# EAGLE design EndStop (EAGLE 7.2.0)
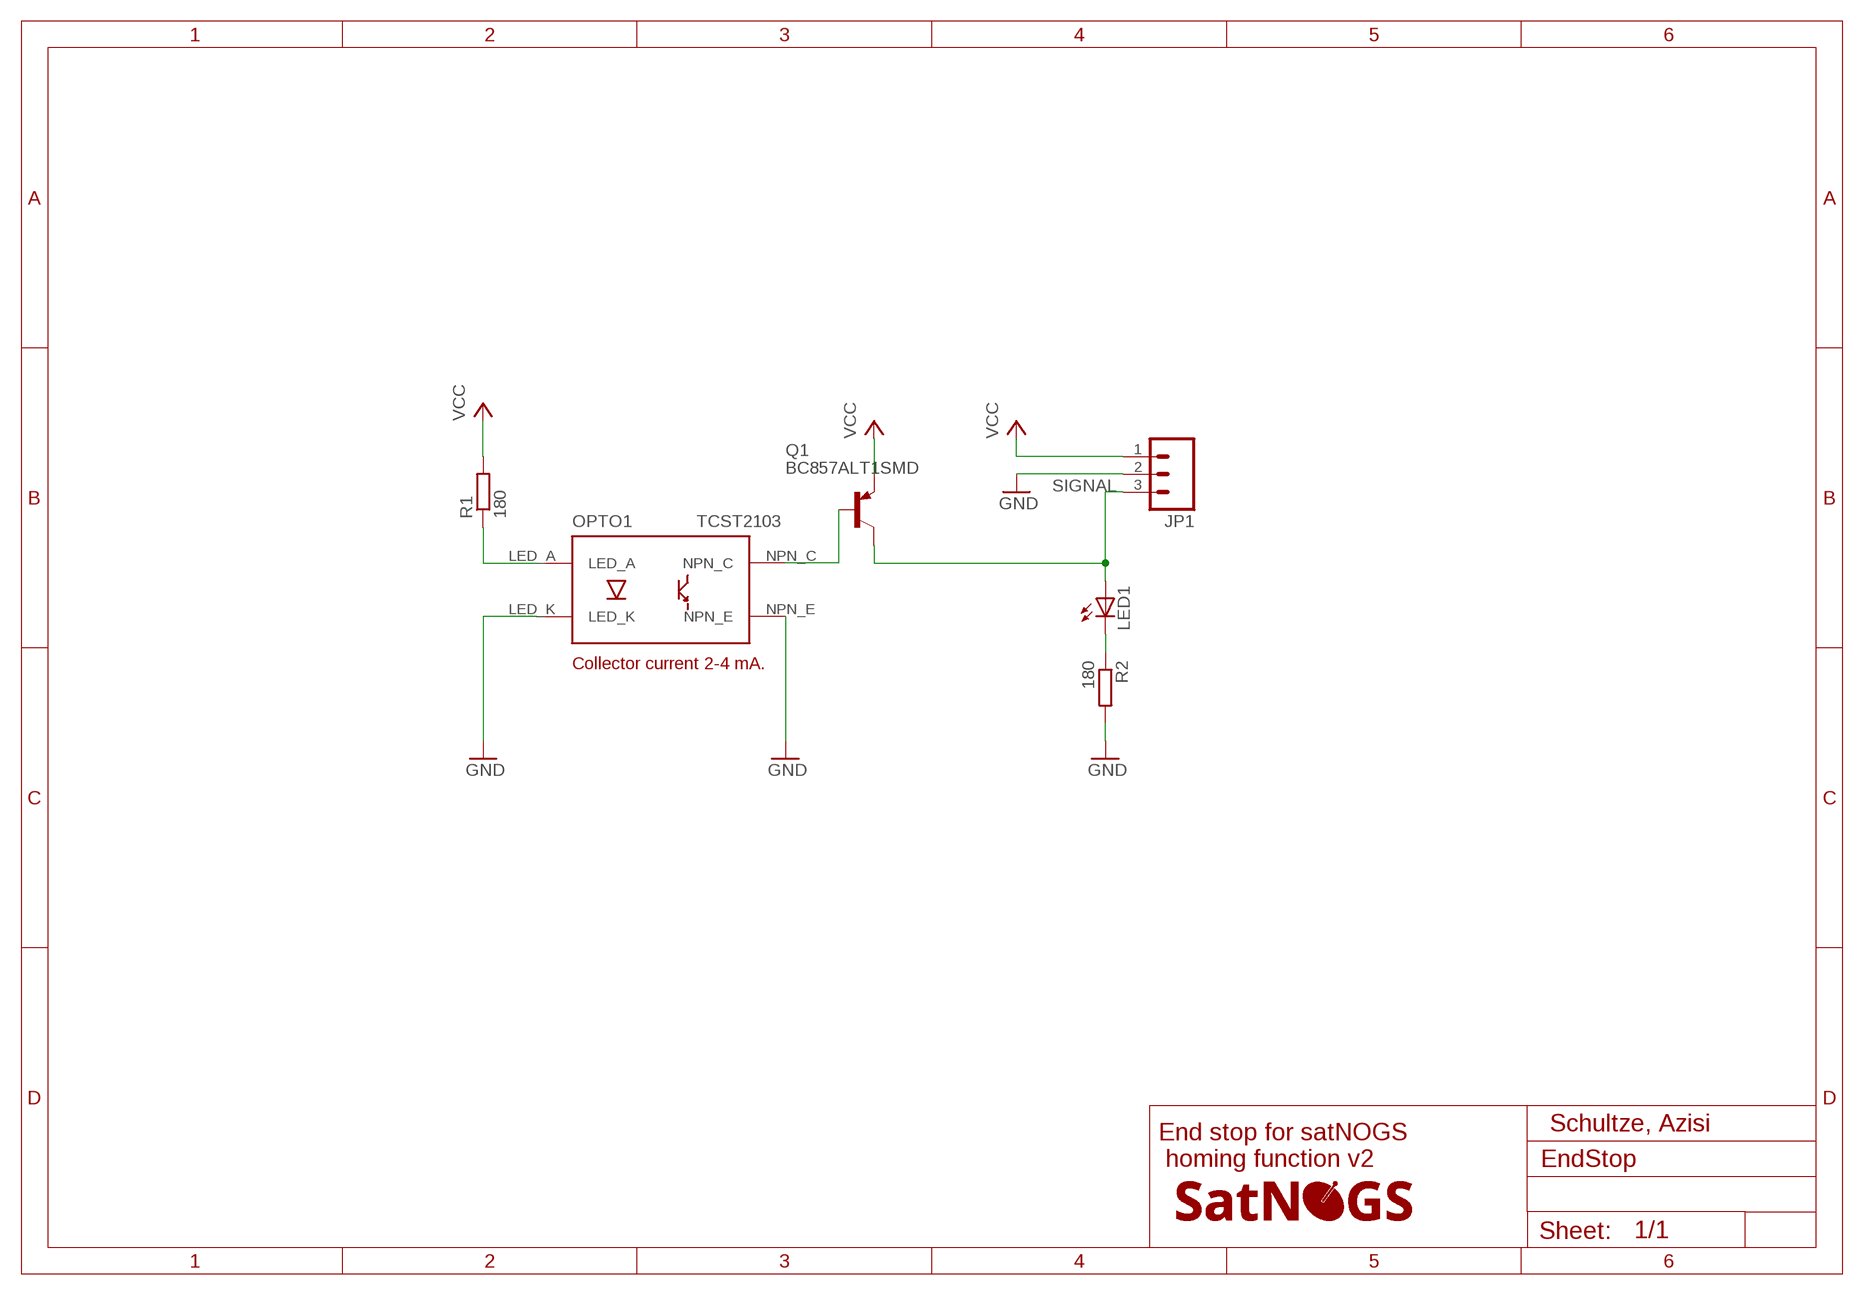
[diagram p0: schematic, sheet 1]

## Parts
JP1  M03PTH  [1X03]
LED1  LED3MM  [LED3MM]
LOGO1  SATNOGS_LOGOSILK_XS  [LOGO_SILK_XS]
OPTO1  TCST2103  [TCST2013]
Q1  BC857ALT1SMD  [SOT23-BEC]
R1  180  R-EU_R0805  [R0805]
R2  180  R-EU_R0805  [R0805]

## Nets
GND: JP1.2 OPTO1.LED_K R2.2
N$2: OPTO1.LED_A R1.1
N$3: LED1.K(C) R2.1
N$4: OPTO1.NPN_C Q1.B
SIGNAL: JP1.3 LED1.A Q1.C
VCC: JP1.1 Q1.E R1.2
Unconnected: OPTO1.NPN_E

## Notes on the sheet
- Collector current 2-4 mA.
- Schultze, Azisi
- End stop for satNOGS
   homing function v2

## Library data of the parts
JP1 = SparkFun-Connectors:M03: Header 3 Standard 3-pin 0.1" header. Use with straight break away headers (SKU : PRT-00116), right angle break away headers (PRT-00553), swiss pins (PRT-00743), machine pins (PRT-00117), and female headers (PRT-00115). Molex polarized connector foot print use with SKU : PRT-08232 with associated crimp pins and housings.
LED1 = led:LED: LED OSRAM: - CHIPLED LG R971, LG N971, LY N971, LG Q971, LY Q971, LO R971, LY R971 LH N974, LH R974 LS Q976, LO Q976, LY Q976 LO Q996 - Hyper CHIPLED LW Q18S LB Q993, LB Q99A, LB R99A - SideLED LS A670, LO A670, LY A670, LG A670, LP A670 LB A673, LV A673, LT A673, LW A673 LH A674 LY A675 LS A676, LA A676, LO A676, LY A676, LW A676 LS A679, LY A679, LG A679 - Hyper Micro SIDELED® LS Y876, LA Y876, LO Y876, LY Y876 LT Y87S - SmartLED LW L88C, LW L88S LB L89C, LB L89S, LG L890 LS L89K, LO L89K, LY L89K LS L896, LA L896, LO L896, LY L896 - TOPLED LS T670, LO T670, LY T670, LG T670, LP T670 LSG T670, LSP T670, LSY T670, LOP T670, LYG T670 LG T671, LOG T671, LSG T671 LB T673, LV T673, LT T673, LW T673 LH T674 LS T676, LA T676, LO T676, LY T676, LB T676, LH T676, LSB T676, LW T676 LB T67C, LV T67C, LT T67C, LS T67K, LO T67K, LY T67K, LW E67C LS E67B, LA E67B, LO E67B, LY E67B, LB E67C, LV E67C, LT E67C LW T67C LS T679, LY T679, LG T679 LS T770, LO T770, LY T770, LG T770, LP T770 LB T773, LV T773, LT T773, LW T773 LH T774 LS E675, LA E675, LY E675, LS T675 LS T776, LA T776, LO T776, LY T776, LB T776 LHGB T686 LT T68C, LB T68C - Hyper Mini TOPLED® LB M676 - Mini TOPLED Santana® LG M470 LS M47K, LO M47K, LY M47K Source: http://www.osram.convergy.de LUXEON: - LUMILED® LXK2-PW12-R00, LXK2-PW12-S00, LXK2-PW14-U00, LXK2-PW14-V00 LXK2-PM12-R00, LXK2-PM12-S00, LXK2-PM14-U00 LXK2-PE12-Q00, LXK2-PE12-R00, LXK2-PE12-S00, LXK2-PE14-T00, LXK2-PE14-U00 LXK2-PB12-K00, LXK2-PB12-L00, LXK2-PB12-M00, LXK2-PB14-N00, LXK2-PB14-P00, LXK2-PB14-Q00 LXK2-PR12-L00, LXK2-PR12-M00, LXK2-PR14-Q00, LXK2-PR14-R00 LXK2-PD12-Q00, LXK2-PD12-R00, LXK2-PD12-S00 LXK2-PH12-R00, LXK2-PH12-S00 LXK2-PL12-P00, LXK2-PL12-Q00, LXK2-PL12-R00 Source: www.luxeon.com KINGBRIGHT: KA-3528ASYC Source: www.kingbright.com
LOGO1 = satnogs:SATNOGS_LOGO
OPTO1 = satnogs:TCST2103
Q1 = transistor-pnp:BC857*: PNP Transistror
R1 R2 = rcl:R-EU_: RESISTOR, European symbol

## Net classes
0 default: width 0.508 mm, drill 0.813 mm, clearance 0.254 mm

## Board
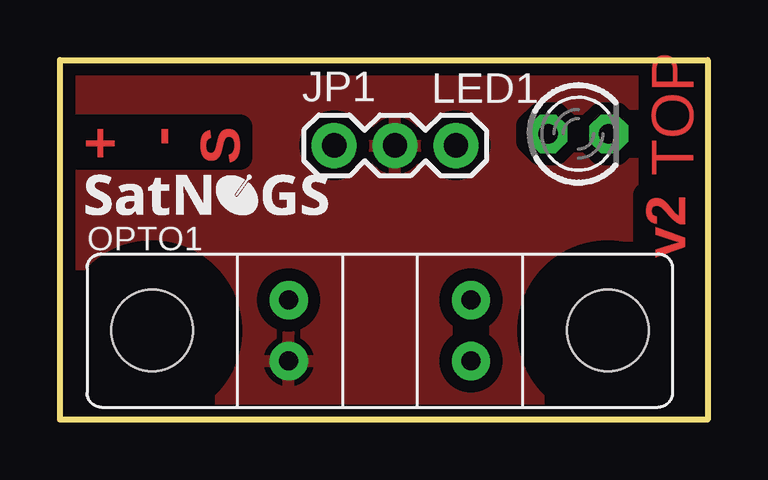
[diagram p1: board, top side]
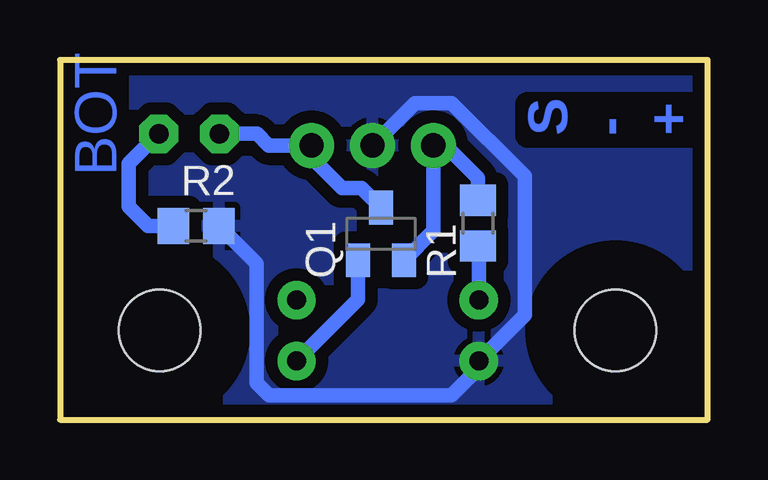
[diagram p2: board, bottom side, seen from below]

Size 27 x 15 mm. Coordinates in mm from the lower left corner, seen from the top.
Outline: 0,0 0,15 27,15 27,0 0,0
Copper layers (1*16): Top 0.035mm / dielectric 1.5mm / Bottom 0.035mm
Design rules "SeeedStudio_2layer_DRU_no_angle_20140221 *": minimum track width 16mil, minimum drill 0.8mm, track to track 6mil, track to pad 6mil, pad to pad 6mil, via to via 6mil, smd to smd 0mil, copper to edge 10mil, drill to drill 10mil, minimum pad ring 0.4mm, minimum via ring 0.4mm, stop-mask expansion 2mil, vias tented up to drill 100mil, thermal gap 10mil

### Footprints (pad centres in the part's own frame; a part is rotated, then mirrored left to right if it is on the bottom)
1X03 = drill 1.016 pad 1.88: 1 0,0; 2 2.54,0; 3 5.08,0
LED3MM = drill 0.813 octagon: A -1.27,0; K 1.27,0
TCST2013 = drill 0.8: LED_A -3.8,1.27; LED_K -3.8,-1.27; NPN_C 3.8,-1.27; NPN_E 3.8,1.27 | hole 3.4: -9.5,0; 9.5,0
SOT23-BEC = smd 1 x 1.4: B -0.95,-1.1; C 0,1.1; E 0.95,-1.1
R0805 = smd 1.3 x 1.5: 1 -0.95,0; 2 0.95,0

### Placement (x,y rotation side)
JP1  11.43,11.43 0 top
LED1  21.61,11.92 0 top
LOGO1  1.08,8.53 0 top
OPTO1  13.34,3.71 0 top
Q1  13.62,7.75 0 bottom
R1  9.57,8.19 90 bottom
R2  21.32,8.08 0 bottom

### Tracks (layer width: path | path; a pad name or v marks a point on that pad's centre or on a via)
GND
  Bottom 0.61: JP1.2 12.19,13.21 10.67,13.21 7.62,10.16 7.62,4.36 OPTO1.LED_K 9.54,2.15 10.67,1.02 18.29,1.02 18.8,1.52 18.8,6.5 R2.2
  pour Bottom (isolate 0.508): 27,0 0,0 0,15 27,15
  pour Top (isolate 0.508, rank 2): 0,0 27.05,0 27.05,15.11 0,15.11
N$2
  Bottom 0.61: OPTO1.LED_A 9.54,7.2 R1.1
N$3
  Bottom 0.61: LED1.K 24.13,10.68 24.13,8.89 23.32,8.08 R2.1
N$4
  Bottom 0.61: OPTO1.NPN_C 14.56,5.01 Q1.B
SIGNAL
  Bottom 0.61: Q1.C 14.42,9.65 15.24,9.65 16.51,10.92 JP1.3 18.3,11.43 18.79,11.92 LED1.A
VCC
  Bottom 0.61: Q1.E 11.43,7.88 JP1.1 10.92,11.43 9.57,10.08 R1.2

### Text on the board
Top: + / - / S | TOP | v2
Bottom: S / - / + | BOT
tValues: v2